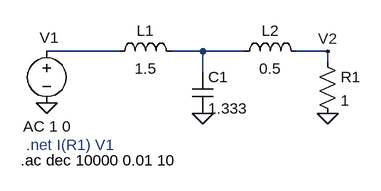
[diagram p0: schematic P1.asc]
P1.asc, the LTspice schematic file:
Version 4
SHEET 1 880 680
WIRE 48 128 -64 128
WIRE 176 128 128 128
WIRE 240 128 176 128
WIRE 368 128 320 128
WIRE 368 144 368 128
WIRE 176 160 176 128
FLAG 176 224 0
FLAG 368 224 0
FLAG -64 208 0
FLAG 368 128 V2
SYMBOL ind 32 144 R270
WINDOW 0 32 56 VTop 2
WINDOW 3 5 56 VBottom 2
SYMATTR InstName L1
SYMATTR Value 1.5
SYMBOL ind 224 144 R270
WINDOW 0 32 56 VTop 2
WINDOW 3 5 56 VBottom 2
SYMATTR InstName L2
SYMATTR Value 0.5
SYMBOL cap 160 160 R0
SYMATTR InstName C1
SYMATTR Value 1.333
SYMBOL res 352 128 R0
SYMATTR InstName R1
SYMATTR Value 1
SYMBOL voltage -64 112 R0
WINDOW 0 -11 -5 Left 2
WINDOW 3 -62 62 Left 2
WINDOW 123 -36 132 Left 2
WINDOW 39 0 0 Left 0
SYMATTR InstName V1
SYMATTR Value ""
SYMATTR Value2 AC 1 0
TEXT -96 272 Left 2 ;.net I(R1) V1
TEXT -104 296 Left 2 !.ac dec 10000 0.01 10

The netlist it stands for:
* P1.asc
L1 N001 N002 1.5
L2 N002 V2 0.5
C1 N002 0 1.333
R1 V2 0 1
V1 N001 0 AC 1 0
* .net I(R1) V1
.ac dec 10000 0.01 10
.backanno
.end